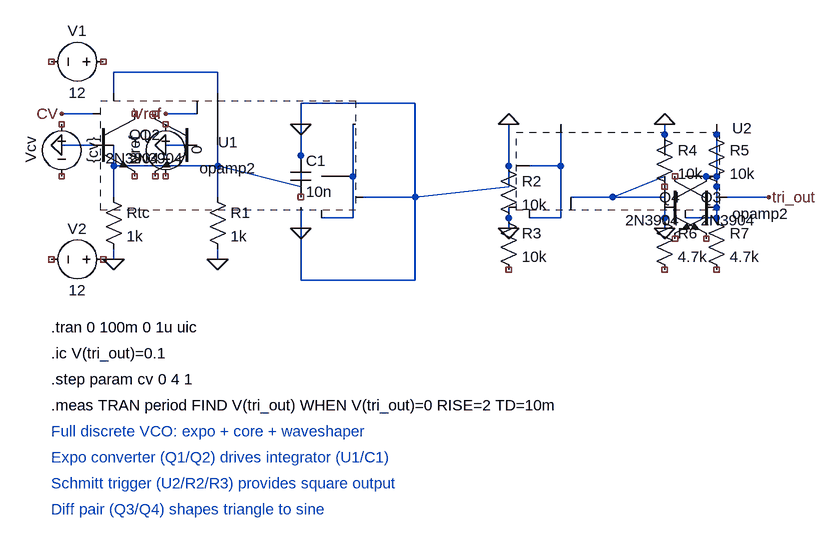
[diagram p0: schematic full-discrete-vco.asc]
full-discrete-vco.asc, the LTspice schematic file:
Version 4
SHEET 1 1760 1000
WIRE 192 160 192 128
WIRE 192 272 192 240
WIRE 352 160 352 128
WIRE 352 272 352 240
WIRE 192 128 352 128
WIRE 192 272 352 272
WIRE 112 192 160 192
WIRE 112 240 160 240
WIRE 272 192 320 192
WIRE 272 240 320 240
WIRE 192 320 192 272
WIRE 352 320 352 272
WIRE 192 416 192 400
WIRE 352 416 352 400
WIRE 480 256 480 208
WIRE 480 368 480 336
WIRE 560 288 560 208
WIRE 560 288 512 288
WIRE 560 352 512 352
WIRE 560 352 560 288
WIRE 352 272 480 304
WIRE 480 304 480 256
WIRE 656 320 576 320
WIRE 656 320 656 176
WIRE 656 176 480 176
WIRE 480 176 480 208
WIRE 656 320 656 448
WIRE 656 448 480 448
WIRE 480 448 480 368
WIRE 800 256 800 208
WIRE 800 368 800 336
WIRE 880 272 880 208
WIRE 880 272 832 272
WIRE 880 352 832 352
WIRE 880 352 880 272
WIRE 656 320 800 304
WIRE 800 304 800 256
WIRE 960 320 896 320
WIRE 1040 320 960 320
WIRE 1040 256 1040 208
WIRE 1040 368 1040 336
WIRE 1120 288 1120 208
WIRE 1120 288 1072 288
WIRE 1120 352 1072 352
WIRE 1120 352 1120 288
WIRE 960 320 1040 288
WIRE 1200 320 1136 320
FLAG 192 416 0
FLAG 352 416 0
FLAG 112 192 CV
FLAG 112 240 0
FLAG 272 240 0
FLAG 272 192 Vref
FLAG 480 208 0
FLAG 480 368 0
FLAG 800 208 0
FLAG 800 368 0
FLAG 1040 208 0
FLAG 1040 368 0
FLAG 1200 320 tri_out
SYMBOL npn 160 192 R0
SYMATTR InstName Q1
SYMATTR Value 2N3904
SYMBOL npn 320 192 M0
SYMATTR InstName Q2
SYMATTR Value 2N3904
SYMBOL res 176 304 R0
SYMATTR InstName Rtc
SYMATTR Value 1k
SYMATTR SpiceLine tc1=3.353e-3 tc2=0
SYMBOL res 336 304 R0
SYMATTR InstName R1
SYMATTR Value 1k
SYMBOL cap 464 256 R0
SYMATTR InstName C1
SYMATTR Value 10n
SYMBOL opamp2 544 320 R0
SYMATTR InstName U1
SYMATTR Value2 Avol=100K GBW=3Meg Slew=13Meg
SYMBOL res 784 256 R0
SYMATTR InstName R2
SYMATTR Value 10k
SYMBOL res 784 336 R0
SYMATTR InstName R3
SYMATTR Value 10k
SYMBOL opamp2 864 320 R0
SYMATTR InstName U2
SYMATTR Value2 Avol=100K GBW=3Meg Slew=13Meg
SYMBOL npn 1040 288 R0
SYMATTR InstName Q3
SYMATTR Value 2N3904
SYMBOL npn 1120 288 M0
SYMATTR InstName Q4
SYMATTR Value 2N3904
SYMBOL res 1024 208 R0
SYMATTR InstName R4
SYMATTR Value 10k
SYMBOL res 1104 208 R0
SYMATTR InstName R5
SYMATTR Value 10k
SYMBOL res 1024 336 R0
SYMATTR InstName R6
SYMATTR Value 4.7k
SYMBOL res 1104 336 R0
SYMATTR InstName R7
SYMATTR Value 4.7k
SYMBOL voltage 192 112 R90
WINDOW 0 -32 56 VBottom 2
WINDOW 3 32 56 VTop 2
SYMATTR InstName V1
SYMATTR Value 12
SYMBOL voltage 192 416 R90
WINDOW 0 -32 56 VBottom 2
WINDOW 3 32 56 VTop 2
SYMATTR InstName V2
SYMATTR Value 12
SYMBOL voltage 112 192 R0
WINDOW 0 -32 56 VBottom 2
WINDOW 3 32 56 VTop 2
SYMATTR InstName Vcv
SYMATTR Value {cv}
SYMBOL voltage 272 192 R0
WINDOW 0 -32 56 VBottom 2
WINDOW 3 32 56 VTop 2
SYMATTR InstName Vref
SYMATTR Value 0
TEXT 96 520 Left 2 !.tran 0 100m 0 1u uic
TEXT 96 560 Left 2 !.ic V(tri_out)=0.1
TEXT 96 600 Left 2 !.step param cv 0 4 1
TEXT 96 640 Left 2 !.meas TRAN period FIND V(tri_out) WHEN V(tri_out)=0 RISE=2 TD=10m
TEXT 96 680 Left 2 ;Full discrete VCO: expo + core + waveshaper
TEXT 96 720 Left 2 ;Expo converter (Q1/Q2) drives integrator (U1/C1)
TEXT 96 760 Left 2 ;Schmitt trigger (U2/R2/R3) provides square output
TEXT 96 800 Left 2 ;Diff pair (Q3/Q4) shapes triangle to sine

The netlist it stands for:
* full-discrete-vco.asc
Q1 NC_01 0 NC_02 0 2N3904
Q2 NC_03 0 NC_04 0 2N3904
Rtc 0 0 1k tc1=3.353e-3 tc2=0
R1 0 0 1k
C1 0 NC_05 10n
* U1: Avol=100K GBW=3Meg Slew=13Meg (symbol opamp2 not available, pin order unknown); nets seen at it: 0, CV, N001, N002, Vref
R2 0 0 10k
R3 0 NC_06 10k
* U2: Avol=100K GBW=3Meg Slew=13Meg (symbol opamp2 not available, pin order unknown); nets seen at it: 0, N003, N004, N005, tri_out
Q3 N005 0 NC_07 0 2N3904
Q4 NC_08 N005 NC_09 0 2N3904
R4 0 NC_10 10k
R5 N005 N005 10k
R6 0 NC_11 4.7k
R7 N005 NC_12 4.7k
V1 NC_13 NC_14 12
V2 NC_15 NC_16 12
Vcv NC_17 NC_18 {cv}
Vref NC_19 NC_20 0
.model NPN NPN
.model PNP PNP
.lib standard.bjt
.tran 0 100m 0 1u uic
.ic V(tri_out)=0.1
.step param cv 0 4 1
.meas TRAN period FIND V(tri_out) WHEN V(tri_out)=0 RISE=2 TD=10m
* Full discrete VCO: expo + core + waveshaper
* Expo converter (Q1/Q2) drives integrator (U1/C1)
* Schmitt trigger (U2/R2/R3) provides square output
* Diff pair (Q3/Q4) shapes triangle to sine
.backanno
.end